# EAGLE board M225A (EAGLE 6.6.0)
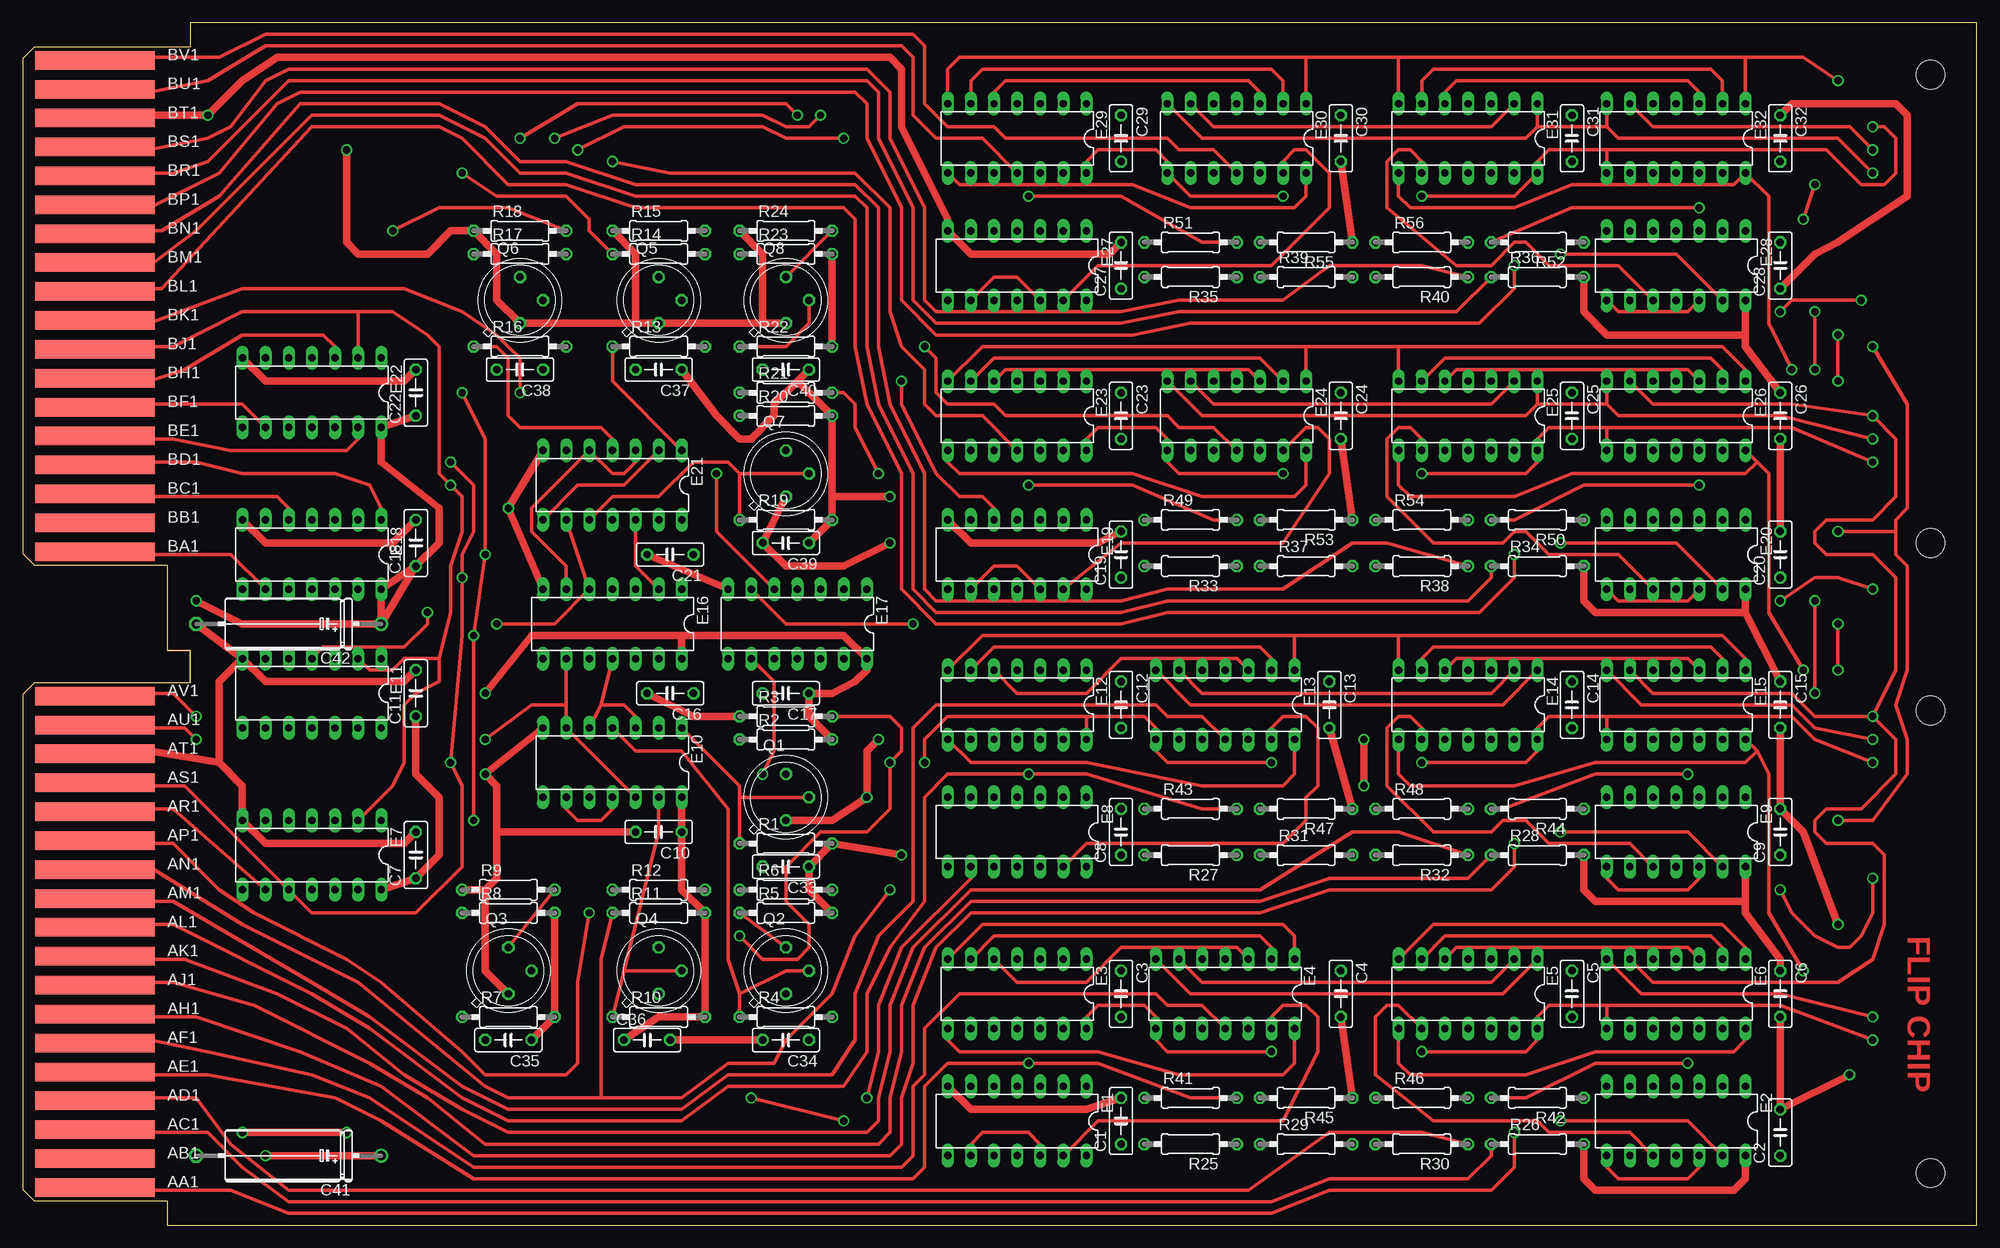
[diagram p2: board, top side]
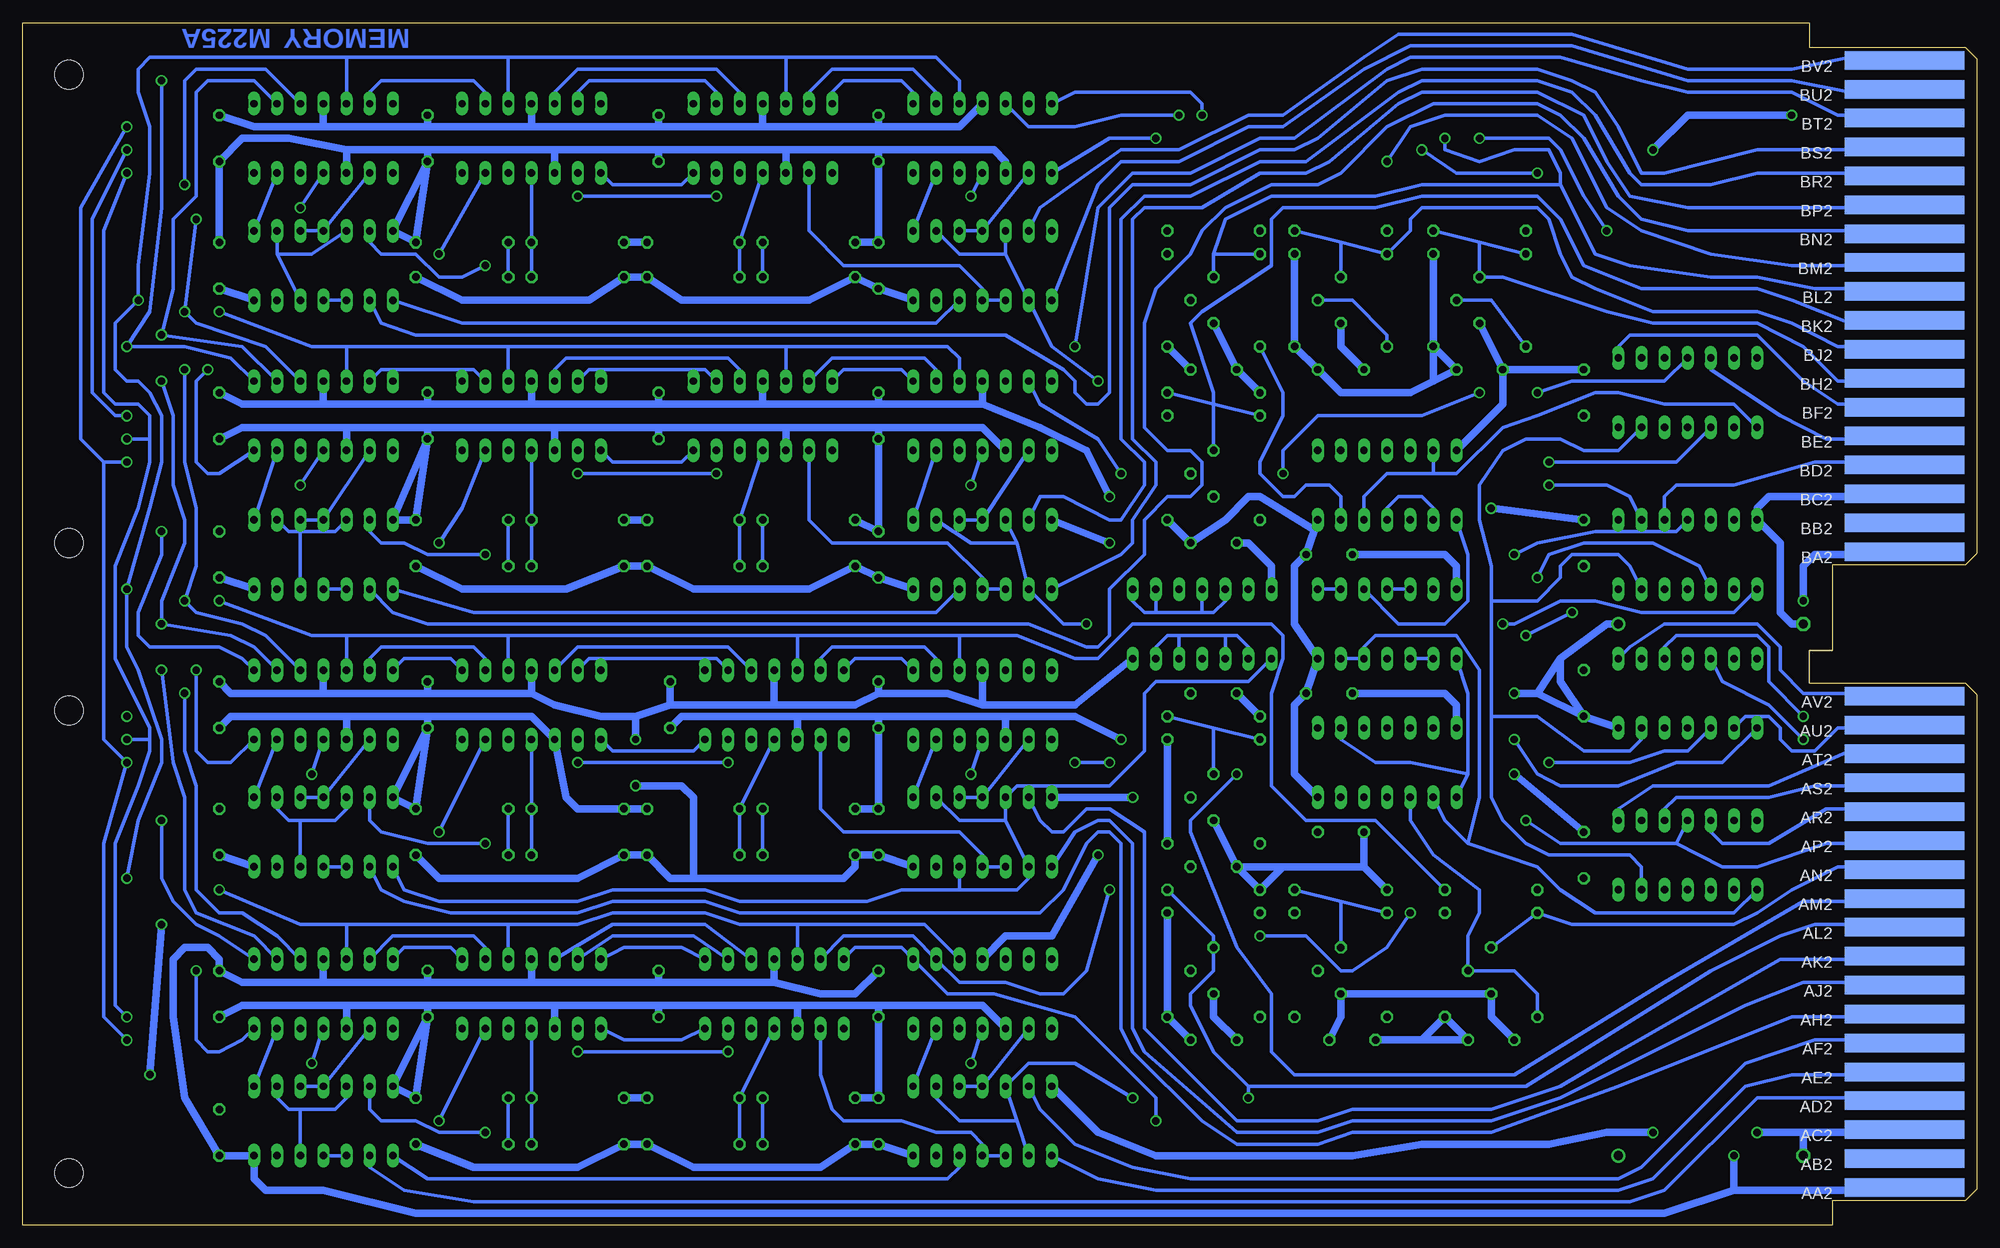
[diagram p3: board, bottom side, seen from below]

Size 214.63 x 132.08 mm. Coordinates in mm from the lower left corner, seen from the top.
Copper layers (1+16): Top 0.035mm / dielectric 1.5mm / Bottom 0.035mm
Design rules "16mils": minimum track width 16mil, minimum drill 32mil, track to track 15mil, track to pad 10mil, pad to pad 10mil, via to via 10mil, smd to smd 10mil, copper to edge 13mil, drill to drill 10mil, minimum pad ring 10mil, minimum via ring 8mil, stop-mask expansion 0mil, vias tented up to drill 0mil, thermal gap 10mil
Net classes: 1 supply: width 0.813 mm

## Footprints (pad centres in the part's own frame; a part is rotated, then mirrored left to right if it is on the bottom)
C050-025X075 = drill 0.813 octagon: 1 -2.54,0; 2 2.54,0
E12-8 = drill 1.016: + -10.16,0 | drill 1.016 octagon: - 10.16,0
DIL14 = drill 0.813 long: 1 -7.62,-3.81; 2 -5.08,-3.81; 3 -2.54,-3.81; 4 0,-3.81; 5 2.54,-3.81; 6 5.08,-3.81; 7 7.62,-3.81; 8 7.62,3.81; 9 5.08,3.81; 10 2.54,3.81; 11 0,3.81; 12 -2.54,3.81; 13 -5.08,3.81; 14 -7.62,3.81
TO5 = drill 0.813 octagon: 1 0,-2.54; 2 2.54,0; 3 0,2.54
0207/10 = drill 0.813 octagon: 1 -5.08,0; 2 5.08,0
DOUBLE-LONG = hole 3.175: 209.55,56.515; 209.55,5.715; 209.55,74.93; 209.55,126.365
EDGE-CON4 = smd 13.106 x 2.032: AA1 7.938,4.128; AB1 7.938,7.303; AC1 7.938,10.477; AD1 7.938,13.652; AE1 7.938,16.828; AF1 7.938,20.003; AH1 7.938,23.177; AJ1 7.938,26.352; AK1 7.938,29.527; AL1 7.938,32.703; AM1 7.938,35.877; AN1 7.938,39.053; AP1 7.938,42.227; AR1 7.938,45.403; AS1 7.938,48.578; AT1 7.938,51.752; AU1 7.938,54.928; AV1 7.938,58.102; BA1 7.938,73.978; BB1 7.938,77.153; BC1 7.938,80.328; BD1 7.938,83.502; BE1 7.938,86.677; BF1 7.938,89.853; BH1 7.938,93.028; BJ1 7.938,96.203; BK1 7.938,99.377; BL1 7.938,102.552; BM1 7.938,105.728; BN1 7.938,108.903; BP1 7.938,112.078; BR1 7.938,115.252; BS1 7.938,118.427; BT1 7.938,121.603; BU1 7.938,124.778; BV1 7.938,127.953 | smd 13.106 x 2.032 bottom: AA2 7.938,4.128; AB2 7.938,7.303; AC2 7.938,10.477; AD2 7.938,13.652; AE2 7.938,16.828; AF2 7.938,20.003; AH2 7.938,23.177; AJ2 7.938,26.352; AK2 7.938,29.527; AL2 7.938,32.703; AM2 7.938,35.877; AN2 7.938,39.053; AP2 7.938,42.227; AR2 7.938,45.403; AS2 7.938,48.578; AT2 7.938,51.752; AU2 7.938,54.928; AV2 7.938,58.102; BA2 7.938,73.978; BB2 7.938,77.153; BC2 7.938,80.328; BD2 7.938,83.502; BE2 7.938,86.677; BF2 7.938,89.853; BH2 7.938,93.028; BJ2 7.938,96.203; BK2 7.938,99.377; BL2 7.938,102.552; BM2 7.938,105.728; BN2 7.938,108.903; BP2 7.938,112.078; BR2 7.938,115.252; BS2 7.938,118.427; BT2 7.938,121.603; BU2 7.938,124.778; BV2 7.938,127.953

## Placement (x,y rotation side)
C1  .01uF  [C050-025X075]  120.65,11.43 90 top
C2  .01uF  [C050-025X075]  193.04,10.16 90 top
C3  .01uF  [C050-025X075]  120.65,25.4 270 top
C4  .01uF  [C050-025X075]  144.78,25.4 270 top
C5  .01uF  [C050-025X075]  170.18,25.4 270 top
C6  .01uF  [C050-025X075]  193.04,25.4 270 top
C7  .01uF  [C050-025X075]  43.18,40.64 90 top
C8  .01uF  [C050-025X075]  120.65,43.18 90 top
C9  .01uF  [C050-025X075]  193.04,43.18 90 top
C10  .01uF  [C050-025X075]  69.85,43.18 180 top
C11  .01uF  [C050-025X075]  43.18,58.42 90 top
C12  .01uF  [C050-025X075]  120.65,57.15 270 top
C13  .01uF  [C050-025X075]  143.51,57.15 270 top
C14  .01uF  [C050-025X075]  170.18,57.15 270 top
C15  .01uF  [C050-025X075]  193.04,57.15 270 top
C16  .01uF  [C050-025X075]  71.12,58.42 180 top
C17  .01uF  [C050-025X075]  83.82,58.42 180 top
C18  .01uF  [C050-025X075]  43.18,74.93 90 top
C19  .01uF  [C050-025X075]  120.65,73.66 90 top
C20  .01uF  [C050-025X075]  193.04,73.66 90 top
C21  .01uF  [C050-025X075]  71.12,73.66 180 top
C22  .01uF  [C050-025X075]  43.18,91.44 90 top
C23  .01uF  [C050-025X075]  120.65,88.9 270 top
C24  .01uF  [C050-025X075]  144.78,88.9 270 top
C25  .01uF  [C050-025X075]  170.18,88.9 270 top
C26  .01uF  [C050-025X075]  193.04,88.9 270 top
C27  .01uF  [C050-025X075]  120.65,105.41 90 top
C28  .01uF  [C050-025X075]  193.04,105.41 90 top
C29  .01uF  [C050-025X075]  120.65,119.38 270 top
C30  .01uF  [C050-025X075]  144.78,119.38 270 top
C31  .01uF  [C050-025X075]  170.18,119.38 270 top
C32  .01uF  [C050-025X075]  193.04,119.38 270 top
C33  .01uF  [C050-025X075]  83.82,39.37 180 top
C34  .01uF  [C050-025X075]  83.82,20.32 180 top
C35  .01uF  [C050-025X075]  53.34,20.32 180 top
C36  .01uF  [C050-025X075]  68.58,20.32 0 top
C37  .01uF  [C050-025X075]  69.85,93.98 180 top
C38  .01uF  [C050-025X075]  54.61,93.98 180 top
C39  .01uF  [C050-025X075]  83.82,74.93 180 top
C40  .01uF  [C050-025X075]  83.82,93.98 180 top
C41  6.8uF  [E12-8]  29.21,7.62 180 top
C42  6.8uF  [E12-8]  29.21,66.04 180 top
E1  7402N  [DIL14]  109.22,11.43 180 top
E2  7402N  [DIL14]  181.61,11.43 180 top
E3  7481  [DIL14]  109.22,25.4 180 top
E4  7481  [DIL14]  132.08,25.4 180 top
E5  7481  [DIL14]  158.75,25.4 180 top
E6  7481  [DIL14]  181.61,25.4 180 top
E7  74H53N  [DIL14]  31.75,40.64 180 top
E8  7402N  [DIL14]  109.22,43.18 180 top
E9  7402N  [DIL14]  181.61,43.18 180 top
E10  N8881N  [DIL14]  64.77,50.8 180 top
E11  74H53N  [DIL14]  31.75,58.42 180 top
E12  7481  [DIL14]  109.22,57.15 180 top
E13  7481  [DIL14]  132.08,57.15 180 top
E14  7481  [DIL14]  158.75,57.15 180 top
E15  7481  [DIL14]  181.61,57.15 180 top
E16  74H00N  [DIL14]  64.77,66.04 180 top
E17  7440N  [DIL14]  85.09,66.04 180 top
E18  74H53N  [DIL14]  31.75,73.66 180 top
E19  7402N  [DIL14]  109.22,73.66 180 top
E20  7402N  [DIL14]  181.61,73.66 180 top
E21  N8881N  [DIL14]  64.77,81.28 180 top
E22  74H53N  [DIL14]  31.75,91.44 180 top
E23  7481  [DIL14]  109.22,88.9 180 top
E24  7481  [DIL14]  133.35,88.9 180 top
E25  7481  [DIL14]  158.75,88.9 180 top
E26  7481  [DIL14]  181.61,88.9 180 top
E27  7402N  [DIL14]  109.22,105.41 180 top
E28  7402N  [DIL14]  181.61,105.41 180 top
E29  7481  [DIL14]  109.22,119.38 180 top
E30  7481  [DIL14]  133.35,119.38 180 top
E31  7481  [DIL14]  158.75,119.38 180 top
E32  7481  [DIL14]  181.61,119.38 180 top
Q1  DEC3009  [TO5]  83.82,46.99 0 top
Q2  DEC3009  [TO5]  83.82,27.94 0 top
Q3  DEC3009  [TO5]  53.34,27.94 0 top
Q4  DEC3009  [TO5]  69.85,27.94 0 top
Q5  DEC3009  [TO5]  69.85,101.6 0 top
Q6  DEC3009  [TO5]  54.61,101.6 0 top
Q7  DEC3009  [TO5]  83.82,82.55 0 top
Q8  DEC3009  [TO5]  83.82,101.6 0 top
R1  330  [0207/10]  83.82,41.91 0 top
R2  100  [0207/10]  83.82,53.34 0 top
R3  1500  [0207/10]  83.82,55.88 0 top
R4  330  [0207/10]  83.82,22.86 0 top
R5  100  [0207/10]  83.82,34.29 0 top
R6  1500  [0207/10]  83.82,36.83 0 top
R7  330  [0207/10]  53.34,22.86 0 top
R8  100  [0207/10]  53.34,34.29 0 top
R9  1500  [0207/10]  53.34,36.83 0 top
R10  330  [0207/10]  69.85,22.86 0 top
R11  100  [0207/10]  69.85,34.29 0 top
R12  1500  [0207/10]  69.85,36.83 0 top
R13  330  [0207/10]  69.85,96.52 0 top
R14  100  [0207/10]  69.85,106.68 0 top
R15  1500  [0207/10]  69.85,109.22 0 top
R16  330  [0207/10]  54.61,96.52 0 top
R17  100  [0207/10]  54.61,106.68 0 top
R18  1500  [0207/10]  54.61,109.22 0 top
R19  330  [0207/10]  83.82,77.47 0 top
R20  100  [0207/10]  83.82,88.9 0 top
R21  1500  [0207/10]  83.82,91.44 0 top
R22  330  [0207/10]  83.82,96.52 0 top
R23  100  [0207/10]  83.82,106.68 0 top
R24  1500  [0207/10]  83.82,109.22 0 top
R25  1K  [0207/10]  128.27,8.89 180 top
R26  1K  [0207/10]  166.37,8.89 0 top
R27  1K  [0207/10]  128.27,40.64 180 top
R28  1K  [0207/10]  166.37,40.64 0 top
R29  1K  [0207/10]  140.97,8.89 0 top
R30  1K  [0207/10]  153.67,8.89 180 top
R31  1K  [0207/10]  140.97,40.64 0 top
R32  1K  [0207/10]  153.67,40.64 180 top
R33  1K  [0207/10]  128.27,72.39 180 top
R34  1K  [0207/10]  166.37,72.39 0 top
R35  1K  [0207/10]  128.27,104.14 180 top
R36  1K  [0207/10]  166.37,104.14 0 top
R37  1K  [0207/10]  140.97,72.39 0 top
R38  1K  [0207/10]  153.67,72.39 180 top
R39  1K  [0207/10]  140.97,104.14 0 top
R40  1K  [0207/10]  153.67,104.14 180 top
R41  3K  [0207/10]  128.27,13.97 0 top
R42  3K  [0207/10]  166.37,13.97 180 top
R43  3K  [0207/10]  128.27,45.72 0 top
R44  3K  [0207/10]  166.37,45.72 180 top
R45  3K  [0207/10]  140.97,13.97 180 top
R46  3K  [0207/10]  153.67,13.97 0 top
R47  3K  [0207/10]  140.97,45.72 180 top
R48  3K  [0207/10]  153.67,45.72 0 top
R49  3K  [0207/10]  128.27,77.47 0 top
R50  3K  [0207/10]  166.37,77.47 180 top
R51  3K  [0207/10]  128.27,107.95 0 top
R52  3K  [0207/10]  166.37,107.95 180 top
R53  3K  [0207/10]  140.97,77.47 180 top
R54  3K  [0207/10]  153.67,77.47 0 top
R55  3K  [0207/10]  140.97,107.95 180 top
R56  3K  [0207/10]  153.67,107.95 0 top
U$1  OUTLINE-DOUBLE-LONG  [DOUBLE-LONG]  0,0 0 top
U$3  [EDGE-CON4]  0,0 0 top

## Tracks (layer width: path | path; a pad name or v marks a point on that pad's centre or on a via)
GND  (via drill 0.81)
  Top 0.813: Q3.1 50.8,27.94 50.8,36.83 | 50.8,36.83 R9.1 | 50.8,36.83 52.07,38.1 52.07,43.18 | 52.07,43.18 52.07,48.26 v50.8,49.53 E10.7 | C10.2 52.07,43.18 | 81.28,99.06 Q5.1 67.31,99.06 | 81.28,99.06 Q8.1 | 67.31,99.06 Q6.1 52.07,101.6 52.07,106.68 R18.1 46.99,109.22 44.45,106.68 36.83,106.68 35.56,107.95 v35.56,118.11 | R15.1 67.31,106.68 67.31,99.06 | R24.1 81.28,106.68 81.28,99.06 | R45.1 C4.2 | v24.13,10.16 v35.56,10.16 | v93.98,53.34 92.71,52.07 v92.71,46.99 88.9,44.45 Q1.1 | C36.2 C34.2 | E11.7 C42.- | U$3.AT1 8.89,52.07 13.97,52.07 21.59,50.8 | 21.59,50.8 21.59,59.69 E11.7 | 21.59,50.8 24.13,48.26 E7.7 26.67,41.91 41.91,41.91 C7.2 | U$3.BT1 8.89,121.92 v20.32,121.92 24.13,125.73 27.94,128.27 95.25,128.27 96.52,127 96.52,120.65 101.6,110.49 E27.7 104.14,106.68 119.38,106.68 C27.2 | E22.7 26.67,92.71 41.91,92.71 C22.2 | E21.7 v53.34,78.74 E16.7 | E18.7 26.67,74.93 40.64,74.93 C18.2 | C11.2 41.91,59.69 26.67,59.69 E11.7 | C6.2 C2.2 v200.66,16.51 | C15.2 C9.2 195.58,43.18 v199.39,33.02 | C26.2 C20.2 | E1.7 104.14,12.7 116.84,12.7 C1.2 | C13.2 R47.1 | C24.2 R53.1 | Q7.1 C39.2 83.82,72.39 90.17,72.39 v95.25,74.93 | C16.2 73.66,55.88 R3.1 | C21.2 E17.7 | R55.1 C30.2 | E19.7 104.14,74.93 118.11,74.93 C19.2
  Bottom 0.813: C35.2 53.34,22.86 Q3.1 Q4.1 69.85,22.86 C36.2 | C7.2 v50.8,49.53 | R12.1 67.31,39.37 | 67.31,39.37 C10.2 | C17.2 R3.1 | Q1.1 C33.2 | C33.2 76.2,39.37 | 76.2,39.37 67.31,39.37 | C33.2 R6.1 76.2,39.37 | C34.2 83.82,22.86 Q2.1 | R45.1 R46.1 | R41.1 C1.2 C3.2 120.65,24.13 | C37.2 69.85,96.52 Q5.1 | C22.2 C38.2 | E21.7 52.07,90.17 C38.2 | Q8.1 C40.2 R21.1 | C38.2 Q6.1 | E17.7 77.47,72.39 80.01,74.93 C39.2 | E16.7 57.15,72.39 58.42,73.66 C21.2 | R47.1 R48.1 153.67,45.72 154.94,46.99 E14.10 158.75,55.88 170.18,55.88 | R43.1 C8.2 C12.2 120.65,55.88 | C14.2 E9.7 R44.1 C14.2 | C14.2 170.18,55.88 | 170.18,55.88 179.07,55.88 | 179.07,55.88 E15.10 | C15.2 191.77,55.88 179.07,55.88 | R49.1 C19.2 C23.2 120.65,87.63 | C25.2 R50.1 E20.7 C25.2 | R54.1 R53.1 | R55.1 R56.1 | C31.2 R52.1 E28.7 C31.2 | R51.1 C27.2 C29.2 120.65,118.11 | C5.2 E2.7 R42.1 C5.2 | U$3.AC2 10.16,10.16 19.05,10.16 | C41.- 19.05,10.16 | 19.05,10.16 v24.13,10.16 | E10.7 57.15,57.15 58.42,58.42 C16.2 | E8.7 v92.71,46.99 | E12.10 106.68,55.88 | 106.68,55.88 120.65,55.88 | C13.2 142.24,55.88 129.54,55.88 | 129.54,55.88 E13.10 | 120.65,55.88 129.54,55.88 | C26.2 190.5,87.63 179.07,87.63 | 179.07,87.63 E26.10 | C25.2 170.18,87.63 | 170.18,87.63 179.07,87.63 | E25.10 156.21,87.63 | 156.21,87.63 170.18,87.63 | C24.2 144.78,87.63 | 144.78,87.63 156.21,87.63 | E24.10 130.81,87.63 | 130.81,87.63 144.78,87.63 | 120.65,87.63 130.81,87.63 | E23.10 109.22,87.63 120.65,87.63 | C42.- 20.32,66.04 21.59,67.31 21.59,74.93 E18.7 24.13,78.74 22.86,80.01 10.16,80.01 U$3.BC2 | E19.7 v95.25,74.93 | C6.2 190.5,24.13 179.07,24.13 | 179.07,24.13 E6.10 | C5.2 170.18,24.13 | 170.18,24.13 179.07,24.13 | E5.10 156.21,24.13 | 156.21,24.13 170.18,24.13
  Bottom 0.813: 156.21,24.13 144.78,24.13 | 144.78,24.13 C4.2 | E4.10 129.54,24.13 | 129.54,24.13 144.78,24.13 | 120.65,24.13 129.54,24.13 | E3.10 109.22,24.13 120.65,24.13 | 179.07,118.11 185.42,119.38 190.5,119.38 C32.2 C28.2 | 179.07,118.11 E32.10 | C31.2 170.18,118.11 | 170.18,118.11 179.07,118.11 | E31.10 156.21,118.11 | 156.21,118.11 170.18,118.11 | C30.2 144.78,118.11 | 144.78,118.11 156.21,118.11 | E30.10 130.81,118.11 | 130.81,118.11 144.78,118.11 | 120.65,118.11 130.81,118.11 | E29.10 106.68,116.84 107.95,118.11 120.65,118.11 | E1.7 96.52,10.16 90.17,7.62 68.58,7.62 60.96,8.89 46.99,8.89 40.64,10.16 v35.56,10.16 | 106.68,55.88 99.06,55.88 v93.98,53.34 | v20.32,121.92 31.75,121.92 v35.56,118.11 | C18.2 v53.34,78.74 | v200.66,16.51 v199.39,33.02
N$1
  Bottom 0.406: E3.9 E1.4 E1.3
N$2  (via drill 0.81)
  Top 0.406: U$3.AH1 8.89,22.86 19.05,22.86 30.48,19.05 39.37,15.24 49.53,7.62 95.25,7.62 96.52,8.89 96.52,13.97 97.79,17.78 97.79,24.13 100.33,30.48 104.14,34.29 135.89,34.29 143.51,36.83 161.29,36.83 163.83,39.37 v163.83,41.91
  Bottom 0.406: E9.6 176.53,44.45 175.26,43.18 170.18,41.91 v163.83,41.91
N$3
  Bottom 0.406: E1.6 102.87,12.7 99.06,8.89 92.71,6.35 86.36,5.08 39.37,5.08 36.83,6.35 25.4,17.78 17.78,20.32 8.89,20.32 U$3.AF2
N$4
  Bottom 0.406: E1.1 E3.13
N$5
  Top 0.406: E1.13 118.11,11.43 138.43,11.43 142.24,19.05 142.24,22.86 140.97,24.13 138.43,24.13 137.16,22.86 E4.13
N$6
  Bottom 0.406: E4.9 127,16.51 125.73,12.7 124.46,11.43 118.11,11.43 114.3,10.16 110.49,10.16 109.22,8.89 E1.11 E1.10
N$7
  Bottom 0.406: U$3.AK2 10.16,29.21 21.59,29.21 39.37,19.05 45.72,15.24 53.34,12.7 68.58,12.7 72.39,11.43 81.28,11.43 91.44,21.59 91.44,43.18 95.25,45.72 97.79,45.72 100.33,43.18 101.6,43.18 102.87,44.45 E8.6
N$8
  Bottom 0.406: U$3.AE2 10.16,16.51 20.32,16.51 25.4,15.24 35.56,5.08 39.37,3.81 90.17,3.81 96.52,5.08 E1.8
N$11  (via drill 0.81)
  Top 0.406: U$3.BK1 8.89,99.06 13.97,99.06 24.13,102.87 41.91,102.87 48.26,100.33 52.07,97.79 53.34,96.52 54.61,95.25 v54.61,91.44 | E17.5 76.2,76.2 v76.2,82.55
  Bottom 0.406: v54.61,91.44 60.96,88.9 72.39,88.9 76.2,85.09 v76.2,82.55 | E17.5 82.55,68.58 83.82,67.31 85.09,67.31 | 85.09,67.31 90.17,67.31 | 90.17,67.31 91.44,67.31 92.71,68.58 E17.1 | E17.2 90.17,67.31 | E17.4 85.09,67.31
N$13
  Top 0.406: U$3.AF1 10.16,20.32 13.97,20.32 20.32,19.05 31.75,16.51 38.1,13.97 49.53,6.35 96.52,6.35 97.79,7.62 97.79,15.24 99.06,16.51 99.06,21.59 102.87,25.4 124.46,25.4 125.73,24.13 129.54,24.13 E4.11
  Bottom 0.406: R29.1 R45.2 E4.11
N$14  (via drill 0.81)
  Top 0.406: U$3.AE1 10.16,16.51 20.32,16.51 34.29,13.97 39.37,11.43 49.53,5.08 97.79,5.08 99.06,6.35 99.06,15.24 101.6,17.78 v110.49,17.78 118.11,17.78 128.27,13.97 R41.2
  Bottom 0.406: R41.2 R25.1 | E3.11 v110.49,17.78
N$15
  Top 0.406: U$3.AD1 8.89,13.97 19.05,13.97 22.86,8.89 29.21,3.81 134.62,3.81 143.51,10.16 153.67,10.16 R30.1
  Bottom 0.406: E5.11 R46.2 R30.1
N$16
  Top 0.406: Q1.2 78.74,46.99 | 78.74,46.99 R1.1 | 78.74,46.99 78.74,48.26 E10.1
N$18  (via drill 0.81)
  Top 0.406: U$3.AC1 8.89,10.16 20.32,10.16 24.13,6.35 29.21,2.54 137.16,2.54 143.51,5.08 158.75,5.08 161.29,7.62 R26.1 | v182.88,17.78 172.72,17.78 165.1,13.97 R42.2
  Bottom 0.406: R26.1 R42.2 | E6.11 v182.88,17.78
N$19
  Top 0.406: R4.1 78.74,25.4 | 78.74,25.4 83.82,27.94 Q2.2 | 78.74,25.4 77.47,29.21 77.47,45.72 72.39,52.07 67.31,52.07 E10.4
N$20  (via drill 0.81)
  Top 0.406: v49.53,44.45 v49.53,64.77 v50.8,73.66 50.8,86.36 v48.26,91.44 | E11.4 33.02,63.5 41.91,63.5 44.45,66.04 v44.45,67.31
  Bottom 0.406: v44.45,67.31 v49.53,64.77 | U$3.AP2 10.16,41.91 16.51,41.91 24.13,39.37 27.94,39.37 33.02,41.91 | 33.02,41.91 E7.4 | 33.02,41.91 45.72,41.91 v49.53,44.45 | E18.4 33.02,76.2 41.91,76.2 48.26,74.93 v50.8,73.66 | E22.4 34.29,92.71 44.45,92.71 v48.26,91.44
N$21
  Bottom 0.406: R7.1 48.26,25.4 50.8,27.94 Q3.2 55.88,31.75 54.61,34.29 54.61,36.83 59.69,40.64 62.23,44.45 E10.10
N$23
  Top 0.406: Q4.2 66.04,27.94 | 66.04,27.94 R10.1 | 66.04,27.94 69.85,43.18 E10.13
N$25
  Top 0.406: R13.1 64.77,92.71 E21.1
  Bottom 0.406: Q5.2 68.58,101.6 64.77,97.79 R13.1
N$26  (via drill 0.81)
  Top 0.406: E8.9 104.14,38.1 96.52,30.48 93.98,24.13 93.98,19.05 v92.71,13.97 | E2.8 173.99,6.35 175.26,5.08 182.88,5.08 184.15,6.35 E2.12 | E9.8 173.99,38.1 175.26,36.83 182.88,36.83 184.15,38.1 E9.12 | E1.12 111.76,8.89 110.49,10.16 105.41,10.16 104.14,8.89 E1.9
  Bottom 0.406: E1.2 114.3,13.97 111.76,11.43 105.41,11.43 | 105.41,11.43 E1.9 | 105.41,11.43 E1.5 104.14,17.78 99.06,17.78 v92.71,13.97 | E2.5 179.07,13.97 180.34,12.7 184.15,12.7 | 184.15,12.7 185.42,12.7 186.69,13.97 E2.2 | E2.12 184.15,12.7 | E2.8 170.18,5.08 113.03,5.08 111.76,6.35 E1.12 | 106.68,44.45 E8.5 105.41,48.26 95.25,48.26 91.44,52.07 91.44,58.42 90.17,59.69 80.01,59.69 E17.8 | 106.68,44.45 E8.9 104.14,38.1 105.41,36.83 111.76,36.83 | E8.2 111.76,44.45 106.68,44.45 | E9.8 172.72,36.83 168.91,35.56 153.67,35.56 149.86,36.83 139.7,36.83 135.89,35.56 121.92,35.56 118.11,36.83 111.76,36.83 | 111.76,36.83 E8.12 | E9.12 184.15,44.45 | 184.15,44.45 185.42,44.45 186.69,45.72 E9.2 | E9.5 179.07,45.72 180.34,44.45 184.15,44.45
N$27
  Top 0.406: E21.4 64.77,86.36 63.5,87.63 54.61,87.63 53.34,88.9 53.34,95.25 52.07,96.52 R16.1
  Bottom 0.406: Q6.2 53.34,101.6 R16.1
N$28
  Bottom 0.406: U$3.AJ2 10.16,26.67 19.05,26.67 25.4,24.13 45.72,13.97 53.34,11.43 68.58,11.43 72.39,10.16 81.28,10.16 91.44,19.05 92.71,21.59 92.71,41.91 95.25,44.45 96.52,44.45 99.06,43.18 E8.8
N$29
  Top 0.406: R19.1 78.74,82.55 | 78.74,82.55 Q7.2 | 78.74,82.55 77.47,83.82 73.66,83.82 69.85,80.01 64.77,80.01 E21.10
N$30  (via drill 0.81)
  Top 0.406: E20.8 175.26,68.58 182.88,68.58 E20.12 | v96.52,92.71 96.52,90.17 100.33,82.55 102.87,80.01 105.41,80.01 106.68,78.74 E19.5 | E17.6 83.82,66.04 v97.79,66.04 | E28.8 175.26,100.33 182.88,100.33 E28.12 | E19.12 109.22,72.39 106.68,72.39 E19.9 | E27.12 109.22,104.14 106.68,104.14 E27.9
  Bottom 0.406: E20.2 185.42,76.2 184.15,76.2 | 184.15,76.2 180.34,76.2 E20.5 | E20.12 184.15,76.2 | E28.12 186.69,106.68 | 186.69,106.68 E28.2 | E28.5 182.88,106.68 186.69,106.68 | E19.2 110.49,74.93 105.41,74.93 | 105.41,74.93 E19.5 | 105.41,74.93 E19.9 100.33,66.04 v97.79,66.04 | E20.8 165.1,67.31 114.3,67.31 E19.12 | E27.2 111.76,106.68 106.68,106.68 | 106.68,106.68 E27.9 101.6,96.52 v96.52,92.71 | E27.5 106.68,106.68 | E27.12 114.3,99.06 166.37,99.06 E28.8
N$31
  Top 0.406: Q8.2 86.36,99.06 83.82,96.52 R22.1
  Bottom 0.406: E21.13 69.85,80.01 71.12,81.28 73.66,81.28 74.93,80.01 76.2,80.01 78.74,82.55 78.74,83.82 76.2,88.9 76.2,91.44 R22.1
N$32
  Bottom 0.406: U$3.BR2 10.16,115.57 24.13,115.57 29.21,114.3 36.83,114.3 38.1,115.57 41.91,121.92 44.45,124.46 48.26,125.73 60.96,125.73 63.5,124.46 73.66,116.84 78.74,116.84 86.36,113.03 91.44,113.03 93.98,110.49 93.98,86.36 91.44,83.82 91.44,81.28 93.98,77.47 95.25,77.47 100.33,80.01 102.87,80.01 E19.6
N$33  (via drill 0.81)
  Top 0.406: U$3.AL1 8.89,33.02 16.51,33.02 31.75,25.4 38.1,21.59 48.26,13.97 53.34,11.43 72.39,11.43 77.47,15.24 90.17,15.24 92.71,19.05 92.71,25.4 95.25,30.48 99.06,35.56 99.06,46.99 101.6,49.53 v110.49,49.53 116.84,49.53 129.54,45.72 R43.2
  Bottom 0.406: R43.2 R27.1 | E12.11 v110.49,49.53
N$34  (via drill 0.81)
  Top 0.406: R28.1 158.75,38.1 143.51,38.1 135.89,35.56 104.14,35.56 99.06,30.48 96.52,24.13 96.52,19.05 95.25,13.97 95.25,10.16 93.98,8.89 50.8,8.89 44.45,13.97 38.1,17.78 25.4,24.13 16.51,26.67 10.16,26.67 U$3.AJ1 | R44.2 162.56,45.72 172.72,49.53 v182.88,49.53
  Bottom 0.406: R44.2 R28.1 | E15.11 v182.88,49.53
N$35
  Top 0.406: U$3.AM1 10.16,35.56 16.51,35.56 31.75,26.67 38.1,22.86 48.26,15.24 53.34,12.7 72.39,12.7 77.47,16.51 88.9,16.51 91.44,20.32 91.44,25.4 93.98,31.75 97.79,35.56 97.79,54.61 100.33,57.15 124.46,57.15 125.73,55.88 129.54,55.88 E13.11
  Bottom 0.406: R31.1 R47.2 E13.11
N$36
  Top 0.406: U$3.AK1 8.89,29.21 17.78,29.21 27.94,25.4 35.56,21.59 41.91,16.51 48.26,12.7 53.34,10.16 92.71,10.16 93.98,11.43 93.98,13.97 95.25,19.05 95.25,24.13 97.79,30.48 104.14,36.83 135.89,36.83 146.05,43.18 151.13,43.18 R32.1
  Bottom 0.406: R32.1 R48.2 E14.11
N$37  (via drill 0.81)
  Top 0.406: v64.77,116.84 71.12,115.57 91.44,115.57 95.25,111.76 95.25,100.33 96.52,96.52 99.06,93.98 99.06,90.17 100.33,88.9 105.41,88.9 E23.11 | v110.49,81.28 121.92,81.28 130.81,77.47 R49.2
  Bottom 0.406: R49.2 R33.1 | U$3.BM2 10.16,105.41 20.32,105.41 29.21,106.68 36.83,109.22 40.64,111.76 44.45,119.38 48.26,121.92 58.42,121.92 62.23,120.65 v64.77,116.84 | E23.11 v110.49,81.28
N$38  (via drill 0.81)
  Top 0.406: U$3.BM1 8.89,105.41 13.97,105.41 19.05,109.22 31.75,121.92 45.72,121.92 50.8,119.38 54.61,115.57 59.69,115.57 67.31,113.03 91.44,113.03 92.71,111.76 92.71,96.52 93.98,90.17 97.79,82.55 97.79,69.85 100.33,67.31 120.65,67.31 125.73,68.58 158.75,68.58 161.29,71.12 R34.1 | R50.2 163.83,77.47 171.45,81.28 v184.15,81.28
  Bottom 0.406: R50.2 R34.1 | E26.11 v184.15,81.28
N$39  (via drill 0.81)
  Top 0.406: U$3.BU1 8.89,124.46 13.97,124.46 20.32,125.73 26.67,129.54 96.52,129.54 97.79,128.27 97.79,121.92 100.33,119.38 105.41,119.38 E29.11 | v110.49,113.03 120.65,113.03 129.54,107.95 R51.2
  Bottom 0.406: R51.2 R35.1 | E29.11 v110.49,113.03
N$40  (via drill 0.81)
  Top 0.406: U$3.BR1 8.89,115.57 16.51,115.57 20.32,116.84 29.21,125.73 92.71,125.73 93.98,124.46 93.98,119.38 97.79,111.76 97.79,101.6 100.33,99.06 120.65,99.06 127,100.33 157.48,100.33 R36.1 | R52.2 170.18,111.76 v184.15,111.76
  Bottom 0.406: R36.1 R52.2 | E32.11 v184.15,111.76
N$41  (via drill 0.81)
  Top 0.406: v99.06,96.52 100.33,95.25 100.33,91.44 101.6,90.17 106.68,90.17 107.95,88.9 125.73,88.9 127,87.63 130.81,87.63 E24.11
  Bottom 0.406: R37.1 R53.2 E24.11 | U$3.BT2 10.16,121.92 15.24,121.92 20.32,124.46 31.75,124.46 36.83,125.73 45.72,128.27 62.23,128.27 64.77,127 74.93,119.38 78.74,119.38 86.36,115.57 92.71,115.57 96.52,111.76 v99.06,96.52
N$42
  Top 0.406: U$3.BN1 8.89,109.22 15.24,109.22 21.59,113.03 30.48,123.19 45.72,123.19 50.8,120.65 54.61,116.84 59.69,116.84 67.31,114.3 91.44,114.3 93.98,111.76 93.98,96.52 95.25,90.17 99.06,82.55 99.06,69.85 100.33,68.58 120.65,68.58 125.73,69.85 138.43,69.85 146.05,74.93 149.86,74.93 R38.1
  Bottom 0.406: R38.1 R54.2 E25.11
N$43
  Top 0.406: U$3.BV1 11.43,128.27 21.59,128.27 26.67,130.81 97.79,130.81 99.06,129.54 99.06,123.19 101.6,120.65 106.68,120.65 107.95,119.38 125.73,119.38 127,118.11 130.81,118.11 E30.11
  Bottom 0.406: R39.1 R55.2 E30.11
N$44
  Top 0.406: U$3.BS1 8.89,118.11 13.97,118.11 20.32,119.38 22.86,120.65 26.67,125.73 29.21,127 92.71,127 95.25,124.46 95.25,119.38 99.06,111.76 99.06,101.6 100.33,100.33 120.65,100.33 127,101.6 138.43,101.6 143.51,105.41 153.67,105.41 R40.1
  Bottom 0.406: R40.1 R56.2 E31.11
N$45
  Top 0.406: U$3.BE1 8.89,86.36 16.51,86.36 22.86,85.09 35.56,85.09 36.83,86.36 E22.13
  Bottom 0.406: E18.13 38.1,72.39 39.37,73.66 44.45,73.66 45.72,72.39 45.72,71.12 48.26,68.58 53.34,68.58 | 53.34,68.58 53.34,72.39 54.61,77.47 54.61,81.28 52.07,85.09 49.53,86.36 45.72,86.36 43.18,85.09 39.37,85.09 E22.13 | 53.34,68.58 53.34,55.88 | 53.34,55.88 48.26,55.88 43.18,52.07 38.1,52.07 36.83,53.34 E11.13 | E7.13 36.83,39.37 38.1,40.64 46.99,40.64 49.53,41.91 52.07,44.45 53.34,46.99 53.34,55.88
N$46
  Top 0.406: U$3.BD1 8.89,83.82 19.05,83.82 24.13,82.55 34.29,82.55 38.1,81.28 39.37,78.74 E18.1
N$47  (via drill 0.81)
  Top 0.406: E7.2 40.64,48.26 41.91,50.8 41.91,57.15 43.18,58.42 45.72,59.69 45.72,62.23 | E22.2 36.83,100.33 | 36.83,100.33 24.13,100.33 16.51,96.52 8.89,96.52 U$3.BJ1 | 36.83,100.33 40.64,100.33 44.45,97.79 45.72,96.52 45.72,82.55 v46.99,81.28 48.26,80.01 48.26,76.2 46.99,72.39 46.99,67.31 45.72,62.23 | E11.2 38.1,60.96 40.64,60.96 41.91,62.23 45.72,62.23
  Bottom 0.406: E18.2 38.1,80.01 40.64,81.28 v46.99,81.28
N$48
  Bottom 0.406: U$3.BD2 10.16,83.82 17.78,83.82 26.67,81.28 33.02,81.28 34.29,80.01 E18.3
N$50
  Top 0.406: U$3.BC1 8.89,80.01 27.94,80.01 29.21,78.74 E18.5
N$51
  Top 0.406: U$3.BA1 8.89,73.66 22.86,73.66 E18.9
N$52  (via drill 0.81)
  Top 0.406: U$3.AS1 8.89,48.26 17.78,48.26 E7.10 31.75,34.29 43.18,34.29 48.26,39.37 48.26,48.26 v46.99,50.8 48.26,64.77 v48.26,71.12 48.26,73.66 49.53,76.2 49.53,81.28 v46.99,83.82
  Bottom 0.406: E18.10 30.48,72.39 35.56,74.93 43.18,74.93 46.99,73.66 v48.26,71.12 | E11.10 31.75,52.07 34.29,52.07 38.1,50.8 v46.99,50.8 | E22.10 33.02,83.82 v46.99,83.82
N$53
  Bottom 0.406: E7.1 39.37,45.72 35.56,48.26 22.86,48.26 13.97,52.07 8.89,52.07 U$3.AT2
N$54
  Bottom 0.406: U$3.BE2 8.89,86.36 16.51,86.36 21.59,88.9 29.21,93.98 E22.5
N$55
  Bottom 0.406: U$3.BF2 10.16,90.17 15.24,90.17 19.05,92.71 24.13,97.79 38.1,97.79 39.37,96.52 E22.1
N$56
  Top 0.406: U$3.BH1 8.89,92.71 13.97,92.71 17.78,93.98 24.13,97.79 33.02,97.79 34.29,96.52 E22.3
N$57
  Top 0.406: U$3.BF1 8.89,90.17 24.13,90.17 E22.9
N$58
  Bottom 0.406: U$3.AU2 8.89,54.61 15.24,54.61 17.78,52.07 20.32,52.07 21.59,53.34 21.59,54.61 22.86,55.88 25.4,55.88 E11.9
N$59  (via drill 0.81)
  Top 0.406: U$3.AV1 8.89,58.42 16.51,58.42 v19.05,55.88
  Bottom 0.406: E11.3 34.29,63.5 33.02,64.77 24.13,64.77 22.86,63.5 22.86,59.69 v19.05,55.88
N$60
  Bottom 0.406: U$3.AV2 11.43,58.42 19.05,58.42 21.59,60.96 21.59,63.5 24.13,66.04 34.29,66.04 38.1,63.5 E11.1
N$61  (via drill 0.81)
  Top 0.406: U$3.AU1 7.62,54.61 17.78,54.61 v19.05,53.34
  Bottom 0.406: E11.5 27.94,59.69 22.86,57.15 v19.05,53.34
N$62
  Top 0.406: U$3.AR1 8.89,45.72 16.51,45.72 E7.9
N$63
  Bottom 0.406: U$3.AS2 10.16,48.26 17.78,48.26 22.86,46.99 33.02,46.99 34.29,45.72 E7.3
N$64
  Bottom 0.406: U$3.AR2 8.89,45.72 16.51,45.72 22.86,41.91 27.94,41.91 29.21,43.18 E7.5
N$65  (via drill 0.81)
  Top 0.406: 59.69,57.15 E10.6 E10.12 | 59.69,57.15 E16.9 | v50.8,53.34 55.88,57.15 59.69,57.15
  Bottom 0.406: E16.10 E16.9 | E11.8 27.94,50.8 33.02,50.8 39.37,48.26 45.72,48.26 48.26,49.53 v50.8,53.34
N$66
  Top 0.406: E10.11 64.77,45.72 63.5,44.45 60.96,44.45 59.69,45.72 E10.9
  Bottom 0.406: E7.8 26.67,34.29 41.91,34.29 45.72,36.83 48.26,39.37 55.88,41.91 | 55.88,41.91 58.42,44.45 E10.9 | 55.88,41.91 54.61,46.99 54.61,60.96 57.15,64.77 66.04,64.77 67.31,63.5 E16.12 E16.13
N$67
  Top 0.406: E16.2 67.31,72.39 E21.12
  Bottom 0.406: E16.2 E16.1 | E21.6 59.69,82.55 | 59.69,82.55 64.77,82.55 67.31,80.01 E21.12 | 59.69,82.55 57.15,82.55 52.07,87.63 48.26,88.9 41.91,91.44 39.37,91.44 34.29,90.17 26.67,90.17 E22.8
N$68  (via drill 0.81)
  Top 0.406: E21.9 E16.5 58.42,66.04 v52.07,66.04
  Bottom 0.406: E16.5 E16.4 | E18.8 26.67,67.31 36.83,67.31 41.91,68.58 45.72,68.58 50.8,66.04 v52.07,66.04 | E21.9 59.69,78.74 60.96,80.01 63.5,80.01 64.77,78.74 E21.11
N$69  (via drill 0.81)
  Top 0.406: E17.9 82.55,59.69 82.55,52.07 v81.28,49.53
  Bottom 0.406: E17.9 80.01,63.5 81.28,64.77 82.55,64.77 | 82.55,64.77 E17.10 | E17.13 90.17,63.5 88.9,64.77 87.63,64.77 | 87.63,64.77 E17.12 | 82.55,64.77 87.63,64.77 | U$3.AM2 10.16,35.56 19.05,35.56 34.29,26.67 50.8,16.51 74.93,16.51 77.47,19.05 77.47,25.4 81.28,30.48 86.36,43.18 86.36,44.45 v81.28,49.53
N$70
  Bottom 0.406: E16.8 55.88,58.42 55.88,49.53 | 55.88,49.53 E10.8 | E10.2 69.85,53.34 66.04,50.8 62.23,50.8 55.88,49.53
N$71
  Top 0.406: E10.5 63.5,57.15 | 63.5,57.15 E16.11 | E10.3 67.31,55.88 66.04,57.15 63.5,57.15
N$72
  Top 0.406: E21.2 66.04,81.28 60.96,81.28 E21.8
  Bottom 0.406: E16.3 63.5,66.04 58.42,66.04 55.88,68.58 55.88,73.66 E21.8
N$73  (via drill 0.81)
  Top 0.406: U$3.AA1 12.7,3.81 22.86,3.81 29.21,1.27 137.16,1.27 143.51,3.81 161.29,3.81 163.83,6.35 v163.83,10.16
  Bottom 0.406: E2.6 176.53,12.7 175.26,11.43 171.45,11.43 168.91,10.16 v163.83,10.16
N$74
  Top 0.406: E16.6 59.69,72.39 55.88,76.2 55.88,78.74 E21.5 64.77,82.55 66.04,82.55 67.31,83.82 E21.3
N$76  (via drill 0.81)
  Top 0.406: U$3.BL1 8.89,102.87 15.24,102.87 31.75,120.65 45.72,120.65 48.26,119.38 53.34,114.3 59.69,114.3 67.31,111.76 90.17,111.76 91.44,110.49 91.44,96.52 92.71,90.17 96.52,82.55 96.52,69.85 100.33,66.04 120.65,66.04 125.73,67.31 160.02,67.31 163.83,71.12 v163.83,73.66
  Bottom 0.406: v163.83,73.66 170.18,73.66 172.72,74.93 175.26,74.93 176.53,76.2 E20.6
N$77
  Bottom 0.406: E15.9 E9.4 E9.3
N$78
  Bottom 0.406: E15.13 E9.1
N$79  (via drill 0.81)
  Top 0.406: v168.91,43.18 182.88,43.18 E9.13
  Bottom 0.406: E14.13 v168.91,43.18
N$80
  Top 0.406: E9.10 176.53,41.91 167.64,41.91 165.1,44.45 162.56,44.45 161.29,43.18 154.94,43.18 149.86,48.26 149.86,54.61 151.13,55.88 152.4,55.88 153.67,54.61 E14.9
  Bottom 0.406: E9.11 E9.10
N$81  (via drill 0.81)
  Top 0.406: U$3.BP1 8.89,111.76 13.97,111.76 21.59,115.57 27.94,123.19 30.48,124.46 91.44,124.46 92.71,123.19 92.71,119.38 96.52,111.76 96.52,101.6 100.33,97.79 121.92,97.79 128.27,99.06 160.02,99.06 163.83,102.87 v163.83,105.41
  Bottom 0.406: v163.83,105.41 166.37,104.14 168.91,104.14 171.45,106.68 175.26,106.68 176.53,107.95 E28.6
N$82
  Bottom 0.406: E12.13 E8.1
N$83
  Top 0.406: E8.13 116.84,41.91 138.43,41.91 140.97,44.45 140.97,46.99 142.24,48.26 142.24,54.61 140.97,55.88 138.43,55.88 137.16,54.61 E13.13
N$84
  Bottom 0.406: E8.10 E8.11 109.22,40.64 111.76,43.18 124.46,43.18 127,45.72 E13.9
N$85
  Bottom 0.406: E2.9 176.53,6.35 172.72,3.81 165.1,2.54 38.1,2.54 34.29,3.81 24.13,13.97 10.16,13.97 U$3.AD2
N$86
  Bottom 0.406: U$3.BV2 11.43,128.27 13.97,128.27 20.32,127 31.75,127 44.45,130.81 63.5,130.81 67.31,128.27 76.2,121.92 80.01,121.92 87.63,118.11 93.98,118.11 102.87,111.76 E27.6
N$87
  Bottom 0.406: E12.9 E8.4 E8.3
N$88
  Bottom 0.406: E6.13 E2.1
N$89  (via drill 0.81)
  Top 0.406: v168.91,11.43 182.88,11.43 E2.13
  Bottom 0.406: E5.13 v168.91,11.43
N$90
  Top 0.406: E2.10 176.53,10.16 167.64,10.16 166.37,11.43 154.94,11.43 148.59,16.51 148.59,22.86 149.86,24.13 151.13,24.13 E5.9
  Bottom 0.406: E2.11 E2.10
N$91
  Bottom 0.406: U$3.AH2 10.16,22.86 20.32,22.86 39.37,15.24 53.34,10.16 68.58,10.16 72.39,8.89 81.28,8.89 85.09,11.43 92.71,19.05 93.98,21.59 93.98,41.91 95.25,43.18 96.52,43.18 97.79,41.91 100.33,36.83 102.87,34.29 135.89,34.29 139.7,35.56 149.86,35.56 153.67,34.29 167.64,34.29 172.72,35.56 175.26,36.83 E9.9
N$92
  Bottom 0.406: U$3.BS2 11.43,118.11 24.13,118.11 34.29,115.57 36.83,115.57 39.37,120.65 41.91,124.46 44.45,125.73 48.26,127 60.96,127 64.77,125.73 72.39,119.38 74.93,118.11 78.74,118.11 86.36,114.3 92.71,114.3 95.25,111.76 95.25,91.44 96.52,90.17 97.79,90.17 99.06,91.44 99.06,92.71 100.33,93.98 106.68,97.79 171.45,97.79 175.26,99.06 E28.9
N$93
  Bottom 0.406: E6.9 E2.4 E2.3
N$94
  Bottom 0.406: E32.13 E28.1
N$95  (via drill 0.81)
  Top 0.406: v168.91,106.68 181.61,106.68 E28.13
  Bottom 0.406: E31.13 v168.91,106.68
N$96
  Top 0.406: E28.10 175.26,105.41 167.64,105.41 165.1,107.95 163.83,107.95 161.29,105.41 157.48,105.41 149.86,111.76 149.86,116.84 151.13,118.11 152.4,118.11 153.67,116.84 E31.9
  Bottom 0.406: E28.10 E28.11
N$97
  Bottom 0.406: E32.9 E28.4 E28.3
N$98
  Bottom 0.406: U$3.BU2 10.16,124.46 13.97,124.46 20.32,125.73 31.75,125.73 44.45,129.54 62.23,129.54 67.31,127 76.2,120.65 80.01,120.65 87.63,116.84 93.98,116.84 96.52,114.3 E27.8
N$99
  Bottom 0.406: E23.13 E19.1
N$100
  Top 0.406: E24.13 140.97,87.63 142.24,87.63 143.51,86.36 143.51,82.55 138.43,74.93 120.65,74.93 E19.13
N$101
  Bottom 0.406: E23.9 E19.4 E19.3
N$102
  Bottom 0.406: E19.10 E19.11 109.22,71.12 113.03,74.93 125.73,74.93 128.27,77.47 E24.9
N$103
  Bottom 0.406: U$3.BN2 10.16,109.22 31.75,109.22 36.83,110.49 39.37,113.03 43.18,119.38 45.72,121.92 48.26,123.19 59.69,123.19 64.77,120.65 69.85,115.57 72.39,114.3 77.47,114.3 82.55,111.76 85.09,109.22 86.36,106.68 90.17,102.87 91.44,99.06 91.44,87.63 88.9,85.09 86.36,85.09 85.09,83.82 85.09,81.28 86.36,80.01 88.9,80.01 91.44,77.47 91.44,73.66 95.25,69.85 95.25,64.77 96.52,63.5 97.79,63.5 104.14,66.04 170.18,66.04 173.99,67.31 E20.9
N$104
  Bottom 0.406: E19.8 93.98,73.66 92.71,74.93 92.71,77.47 90.17,81.28 90.17,83.82 92.71,86.36 92.71,110.49 91.44,111.76 85.09,111.76 78.74,115.57 73.66,115.57 71.12,116.84 63.5,123.19 60.96,124.46 48.26,124.46 43.18,121.92 40.64,116.84 38.1,113.03 31.75,111.76 8.89,111.76 U$3.BP2
N$107
  Bottom 0.406: E26.13 E20.1
N$108  (via drill 0.81)
  Top 0.406: v168.91,74.93 181.61,74.93 E20.13
  Bottom 0.406: E25.13 166.37,78.74 v168.91,74.93
N$109
  Bottom 0.406: E29.13 E27.1
N$110
  Top 0.406: E30.13 138.43,116.84 139.7,118.11 140.97,118.11 143.51,115.57 143.51,111.76 137.16,105.41 118.11,105.41 E27.13
N$111
  Bottom 0.406: E27.10 E27.11 109.22,102.87 111.76,105.41 124.46,105.41 128.27,109.22 E30.9
N$113
  Bottom 0.406: E29.9 E27.4 E27.3
N$115
  Bottom 0.406: E26.9 E20.4 E20.3
N$116
  Top 0.406: E20.10 175.26,73.66 167.64,73.66 165.1,76.2 163.83,76.2 162.56,74.93 154.94,74.93 149.86,80.01 149.86,86.36 151.13,87.63 152.4,87.63 153.67,86.36 E25.9
  Bottom 0.406: E20.10 E20.11
Q1  (via drill 0.81)
  Top 0.406: v153.67,19.05 165.1,19.05 166.37,20.32 E5.14 166.37,22.86 167.64,24.13 173.99,24.13 | v137.16,19.05 125.73,19.05 124.46,20.32 E4.8 124.46,22.86 123.19,24.13 118.11,24.13 116.84,22.86 E3.14 | v137.16,50.8 125.73,50.8 124.46,52.07 E13.8 124.46,54.61 123.19,55.88 116.84,55.88 | v153.67,50.8 165.1,50.8 166.37,52.07 E14.14 166.37,54.61 167.64,55.88 173.99,55.88 | U$3.AP1 8.89,41.91 16.51,41.91 21.59,36.83 25.4,34.29 35.56,29.21 39.37,26.67 48.26,19.05 50.8,16.51 59.69,16.51 60.96,17.78 60.96,26.67 v62.23,34.29 | v153.67,113.03 163.83,113.03 E31.14 166.37,116.84 167.64,118.11 173.99,118.11 | v153.67,82.55 165.1,82.55 166.37,83.82 E25.14 166.37,86.36 167.64,87.63 173.99,87.63 | v138.43,82.55 127,82.55 125.73,83.82 E24.8 125.73,86.36 124.46,87.63 118.11,87.63 116.84,86.36 E23.14 | 173.99,24.13 E6.8 | v78.74,31.75 81.28,29.21 85.09,29.21 86.36,30.48 86.36,33.02 83.82,35.56 83.82,39.37 87.63,43.18 92.71,43.18 95.25,45.72 v95.25,50.8 96.52,52.07 96.52,54.61 95.25,55.88 R3.2 | 116.84,55.88 101.6,55.88 99.06,53.34 v99.06,50.8 | E12.14 116.84,55.88 | 173.99,87.63 E26.8 | E29.14 116.84,116.84 118.11,118.11 124.46,118.11 125.73,116.84 E30.8 128.27,113.03 v138.43,113.03 | 173.99,55.88 E15.8 | v203.2,120.65 204.47,120.65 205.74,119.38 205.74,115.57 204.47,114.3 201.93,114.3 198.12,118.11 173.99,118.11 | 173.99,118.11 E32.8 | v203.2,83.82 194.31,87.63 173.99,87.63 | v203.2,20.32 193.04,24.13 173.99,24.13 | v203.2,50.8 196.85,53.34 194.31,55.88 173.99,55.88
  Bottom 0.406: Q1.3 83.82,54.61 | 83.82,54.61 R2.1 | R3.2 83.82,54.61 | v137.16,19.05 v153.67,19.05 | v137.16,50.8 v153.67,50.8 | v62.23,34.29 64.77,30.48 68.58,27.94 69.85,27.94 73.66,31.75 v78.74,31.75 | v138.43,113.03 v153.67,113.03 | v138.43,82.55 v153.67,82.55 | v95.25,50.8 v99.06,50.8 | v203.2,120.65 208.28,111.76 208.28,86.36 205.74,83.82 | v203.2,20.32 205.74,22.86 205.74,41.91 v203.2,50.8 205.74,53.34 205.74,83.82 | v203.2,83.82 205.74,83.82
Q2  (via drill 0.81)
  Top 0.406: R5.1 Q2.3 | v80.01,13.97 v90.17,11.43 | E4.7 128.27,25.4 162.56,25.4 E5.1 | E25.1 166.37,90.17 | 166.37,90.17 173.99,90.17 | 173.99,90.17 E26.7 | E31.1 166.37,120.65 | 166.37,120.65 173.99,120.65 | 173.99,120.65 E32.7 | E30.7 129.54,119.38 165.1,119.38 166.37,120.65 | E24.7 129.54,88.9 165.1,88.9 166.37,90.17 | E13.7 128.27,57.15 162.56,57.15 E14.1 | 173.99,120.65 175.26,119.38 199.39,119.38 v203.2,115.57 | E6.7 177.8,25.4 193.04,25.4 v203.2,22.86 | v203.2,86.36 193.04,88.9 175.26,88.9 173.99,90.17 | v203.2,53.34 196.85,54.61 194.31,57.15 177.8,57.15 E15.7
  Bottom 0.406: R6.2 83.82,31.75 Q2.3 83.82,27.94 86.36,25.4 86.36,24.13 83.82,19.05 80.01,15.24 | E12.1 118.11,62.23 123.19,62.23 E13.7 | E14.1 167.64,62.23 172.72,62.23 E15.7 | U$3.AL2 10.16,33.02 17.78,33.02 21.59,31.75 29.21,27.94 49.53,15.24 80.01,15.24 | 80.01,15.24 v80.01,13.97 | E23.1 118.11,93.98 124.46,93.98 E24.7 | E4.7 123.19,30.48 118.11,30.48 E3.1 113.03,25.4 107.95,25.4 99.06,22.86 90.17,13.97 v90.17,11.43 | E5.1 167.64,30.48 172.72,30.48 E6.7 | E30.7 125.73,124.46 124.46,125.73 118.11,125.73 116.84,124.46 E29.1 | v203.2,115.57 205.74,109.22 205.74,91.44 204.47,90.17 201.93,90.17 200.66,88.9 200.66,86.36 | v203.2,86.36 200.66,86.36 | 200.66,86.36 200.66,83.82 201.93,78.74 204.47,72.39 204.47,62.23 200.66,54.61 200.66,53.34 | v203.2,22.86 204.47,24.13 204.47,41.91 201.93,48.26 200.66,52.07 200.66,53.34 | 200.66,53.34 v203.2,53.34
Q3  (via drill 0.81)
  Top 0.406: R9.2 Q3.3 | v193.04,100.33 194.31,101.6 v201.93,101.6 | v193.04,36.83 194.31,34.29 196.85,31.75 199.39,30.48 200.66,30.48 201.93,31.75 203.2,34.29 v203.2,38.1 | v203.2,69.85 199.39,71.12 196.85,71.12 v193.04,68.58
  Bottom 0.406: Q3.3 R8.1 44.45,33.02 26.67,33.02 24.13,34.29 20.32,36.83 15.24,39.37 11.43,39.37 U$3.AN2 | E15.5 179.07,64.77 | 179.07,64.77 182.88,64.77 v193.04,68.58 | E14.3 161.29,64.77 | 161.29,64.77 179.07,64.77 | E13.5 129.54,64.77 | 129.54,64.77 161.29,64.77 | 129.54,64.77 111.76,64.77 | 111.76,64.77 E12.3 | E23.3 111.76,95.25 113.03,96.52 130.81,96.52 | 130.81,96.52 E24.5 | 130.81,96.52 161.29,96.52 | 161.29,96.52 E25.3 | 161.29,96.52 179.07,96.52 | 179.07,96.52 E26.5 | 179.07,96.52 182.88,96.52 v193.04,100.33 | E3.3 115.57,33.02 129.54,33.02 | 129.54,33.02 E4.5 | 129.54,33.02 135.89,33.02 139.7,34.29 149.86,34.29 153.67,33.02 161.29,33.02 | 161.29,33.02 E5.3 | 161.29,33.02 179.07,33.02 | 179.07,33.02 E6.5 | 179.07,33.02 184.15,33.02 v193.04,36.83 | E29.3 111.76,125.73 114.3,128.27 130.81,128.27 | 130.81,128.27 E30.5 | 130.81,128.27 161.29,128.27 | 161.29,128.27 E31.3 | E32.5 179.07,128.27 | 179.07,128.27 161.29,128.27 | 179.07,128.27 200.66,128.27 201.93,127 201.93,124.46 200.66,120.65 200.66,115.57 201.93,105.41 v201.93,101.6 204.47,99.06 204.47,93.98 203.2,92.71 201.93,92.71 200.66,91.44 199.39,88.9 199.39,83.82 200.66,78.74 v203.2,69.85 203.2,63.5 201.93,60.96 199.39,53.34 199.39,50.8 201.93,44.45 v203.2,38.1 | R9.2 66.04,44.45 73.66,44.45 77.47,48.26 77.47,58.42 76.2,62.23 76.2,64.77 77.47,66.04 92.71,66.04 96.52,62.23 99.06,62.23 105.41,64.77 111.76,64.77
Q4  (via drill 0.81)
  Top 0.406: v95.25,36.83 91.44,31.75 88.9,25.4 83.82,20.32 82.55,17.78 77.47,17.78 72.39,13.97 63.5,13.97 | R11.1 63.5,29.21 63.5,13.97 | U$3.AN1 8.89,39.37 13.97,39.37 24.13,33.02 36.83,26.67 50.8,15.24 53.34,13.97 63.5,13.97 | E4.6 129.54,26.67 161.29,26.67 E5.2 | E30.6 130.81,120.65 161.29,120.65 E31.2 | E24.6 130.81,90.17 161.29,90.17 E25.2 | E13.6 129.54,58.42 161.29,58.42 E14.2 | E32.6 179.07,120.65 200.66,120.65 v203.2,118.11 | E6.6 179.07,26.67 199.39,26.67 203.2,29.21 204.47,33.02 204.47,40.64 203.2,41.91 198.12,41.91 196.85,43.18 196.85,44.45 198.12,45.72 201.93,45.72 205.74,49.53 205.74,53.34 v203.2,55.88 | v203.2,55.88 196.85,55.88 194.31,58.42 179.07,58.42 E15.6 | v203.2,55.88 205.74,60.96 205.74,71.12 203.2,73.66 198.12,73.66 196.85,74.93 196.85,76.2 198.12,77.47 203.2,77.47 205.74,80.01 205.74,86.36 v203.2,88.9 194.31,90.17 179.07,90.17 E26.6
  Bottom 0.406: Q4.3 69.85,35.56 | R11.1 69.85,35.56 | 69.85,35.56 R12.2 | E12.2 114.3,62.23 115.57,63.5 125.73,63.5 127,62.23 E13.6 | E14.2 163.83,62.23 165.1,63.5 175.26,63.5 176.53,62.23 E15.6 | E25.2 165.1,93.98 175.26,93.98 E26.6 | E23.2 114.3,93.98 115.57,95.25 125.73,95.25 E24.6 | E4.6 124.46,31.75 116.84,31.75 E3.2 111.76,26.67 106.68,26.67 102.87,25.4 100.33,25.4 97.79,27.94 v95.25,36.83 | E5.2 163.83,30.48 165.1,31.75 173.99,31.75 E6.6 | E29.2 114.3,124.46 116.84,127 125.73,127 128.27,124.46 E30.6 | E31.2 163.83,124.46 165.1,125.73 175.26,125.73 176.53,124.46 E32.6 | v203.2,118.11 207.01,110.49 207.01,91.44 204.47,88.9 v203.2,88.9
Q5  (via drill 0.81)
  Top 0.406: E3.8 101.6,20.32 102.87,19.05 118.11,19.05 127,16.51 138.43,16.51 139.7,17.78 E4.14 | E12.8 104.14,50.8 116.84,50.8 129.54,48.26 138.43,48.26 139.7,49.53 E13.14 | v48.26,115.57 52.07,113.03 59.69,113.03 62.23,110.49 62.23,109.22 R14.1 | v60.96,118.11 66.04,120.65 81.28,120.65 83.82,119.38 v90.17,119.38 | E5.8 151.13,17.78 152.4,16.51 165.1,16.51 172.72,19.05 187.96,19.05 189.23,20.32 E6.14 | v195.58,27.94 191.77,34.29 191.77,49.53 190.5,52.07 | 190.5,52.07 E15.14 | 190.5,52.07 189.23,50.8 172.72,50.8 163.83,48.26 152.4,48.26 151.13,49.53 E14.8 | v194.31,93.98 191.77,99.06 191.77,113.03 E32.14 187.96,114.3 170.18,114.3 163.83,111.76 152.4,111.76 151.13,113.03 E31.8 | v195.58,60.96 191.77,67.31 191.77,82.55 190.5,83.82 | 190.5,83.82 E26.14 | 190.5,83.82 189.23,82.55 170.18,82.55 163.83,80.01 152.4,80.01 151.13,81.28 E25.8 | E23.8 101.6,83.82 102.87,82.55 121.92,82.55 129.54,80.01 139.7,80.01 140.97,81.28 E24.14 | E29.8 102.87,114.3 121.92,114.3 128.27,111.76 139.7,111.76 140.97,113.03 E30.14
  Bottom 0.406: Q5.3 69.85,107.95 | 69.85,107.95 R15.2 | 69.85,107.95 R14.1 62.23,109.22 62.23,110.49 60.96,111.76 48.26,111.76 46.99,110.49 45.72,106.68 44.45,104.14 41.91,102.87 35.56,100.33 24.13,100.33 20.32,99.06 15.24,96.52 8.89,96.52 U$3.BJ2 | E6.14 190.5,20.32 193.04,19.05 194.31,19.05 195.58,20.32 v195.58,27.94 | E13.14 140.97,52.07 149.86,52.07 E14.8 | E15.14 191.77,50.8 194.31,50.8 195.58,52.07 v195.58,60.96 | E4.14 142.24,20.32 148.59,20.32 E5.8 | E24.14 142.24,83.82 149.86,83.82 E25.8 | E30.14 142.24,114.3 149.86,114.3 E31.8 | E29.8 95.25,119.38 v90.17,119.38 | E26.14 193.04,82.55 194.31,82.55 195.58,83.82 195.58,92.71 v194.31,93.98 | v60.96,118.11 57.15,115.57 v48.26,115.57
Q6  (via drill 0.81)
  Top 0.406: v40.64,109.22 45.72,111.76 53.34,111.76 R18.2 | v54.61,119.38 60.96,123.19 83.82,123.19 v85.09,121.92 | E3.7 105.41,33.02 138.43,33.02 139.7,31.75 E4.1 | E5.7 154.94,33.02 186.69,33.02 189.23,30.48 E6.1 | v199.39,44.45 203.2,44.45 207.01,49.53 207.01,53.34 205.74,57.15 207.01,60.96 207.01,72.39 205.74,73.66 205.74,76.2 | v199.39,76.2 205.74,76.2 | 205.74,76.2 205.74,77.47 207.01,78.74 207.01,90.17 v203.2,96.52 | E32.1 189.23,128.27 | 189.23,128.27 195.58,128.27 v199.39,125.73 | E31.7 151.13,128.27 | 151.13,128.27 189.23,128.27 | E15.1 189.23,62.23 186.69,64.77 151.13,64.77 | E14.7 151.13,64.77 | E13.1 139.7,64.77 | 139.7,64.77 151.13,64.77 | E12.7 105.41,64.77 139.7,64.77 | E23.7 105.41,96.52 140.97,96.52 | 140.97,96.52 E24.1 | 140.97,96.52 151.13,96.52 | 151.13,96.52 E25.7 | E26.1 189.23,93.98 186.69,96.52 151.13,96.52 | E29.7 101.6,127 102.87,128.27 140.97,128.27 | 140.97,128.27 E30.1 | 140.97,128.27 151.13,128.27
  Bottom 0.406: R17.1 54.61,107.95 | 54.61,107.95 Q6.3 52.07,104.14 40.64,100.33 35.56,99.06 24.13,99.06 19.05,96.52 15.24,92.71 8.89,92.71 U$3.BH2 | 54.61,107.95 R18.2 | E15.1 190.5,62.23 193.04,63.5 200.66,63.5 201.93,64.77 201.93,67.31 199.39,73.66 v199.39,76.2 | E4.1 142.24,30.48 148.59,30.48 E5.7 | E6.1 193.04,31.75 195.58,33.02 198.12,35.56 199.39,38.1 v199.39,44.45 | E29.7 99.06,124.46 86.36,124.46 85.09,123.19 v85.09,121.92 | E26.1 191.77,95.25 196.85,96.52 v203.2,96.52 200.66,100.33 199.39,111.76 v199.39,125.73 | v40.64,109.22 43.18,113.03 45.72,118.11 46.99,119.38 v54.61,119.38
Q7  (via drill 0.81)
  Top 0.406: E3.6 106.68,31.75 135.89,31.75 137.16,30.48 E4.2 | E5.6 156.21,31.75 185.42,31.75 186.69,30.48 E6.2 | v199.39,92.71 v199.39,97.79 | E31.6 153.67,125.73 154.94,127 185.42,127 186.69,125.73 E32.2 | v199.39,60.96 v199.39,66.04 | E14.6 153.67,62.23 154.94,63.5 185.42,63.5 186.69,62.23 E15.2 | E12.6 106.68,63.5 135.89,63.5 137.16,62.23 E13.2 | R21.2 90.17,91.44 91.44,90.17 91.44,87.63 v93.98,82.55 | E23.6 106.68,95.25 135.89,95.25 E24.2 | E25.6 156.21,95.25 185.42,95.25 186.69,93.98 E26.2 | E29.6 104.14,125.73 105.41,127 137.16,127 138.43,125.73 E30.2
  Bottom 0.406: R20.1 83.82,90.17 | 83.82,90.17 Q7.3 | R21.2 83.82,90.17 | E15.2 189.23,63.5 191.77,64.77 v199.39,66.04 199.39,68.58 196.85,74.93 196.85,77.47 198.12,81.28 198.12,88.9 v199.39,92.71 | E13.2 138.43,62.23 152.4,62.23 E14.6 | E4.2 140.97,31.75 149.86,31.75 E5.6 | U$3.BK2 11.43,99.06 13.97,99.06 20.32,101.6 24.13,102.87 36.83,102.87 43.18,105.41 45.72,110.49 48.26,113.03 60.96,113.03 66.04,111.76 76.2,111.76 77.47,110.49 77.47,105.41 85.09,100.33 86.36,99.06 83.82,91.44 83.82,90.17 | E24.2 139.7,93.98 152.4,93.98 E25.6 | E23.6 102.87,90.17 96.52,86.36 v93.98,82.55 | E6.2 189.23,31.75 195.58,34.29 196.85,36.83 196.85,46.99 198.12,50.8 v199.39,60.96 | E31.6 153.67,124.46 152.4,125.73 139.7,125.73 138.43,124.46 E30.2 | E32.2 189.23,125.73 194.31,125.73 195.58,124.46 195.58,113.03 198.12,110.49 198.12,102.87 v199.39,97.79 190.5,96.52 E26.2
Q8  (via drill 0.81)
  Top 0.406: R24.2 Q8.3 | v58.42,119.38 64.77,121.92 81.28,121.92 83.82,120.65 86.36,120.65 v87.63,121.92 | E4.3 133.35,30.48 120.65,30.48 116.84,26.67 109.22,26.67 E3.5 | E5.5 157.48,30.48 182.88,30.48 E6.3 | v196.85,93.98 v196.85,100.33 | v195.58,110.49 v196.85,114.3 | E32.3 184.15,124.46 182.88,125.73 157.48,125.73 156.21,124.46 E31.5 | v196.85,58.42 v196.85,68.58 | E14.5 157.48,62.23 182.88,62.23 E15.3 | E13.3 133.35,62.23 120.65,62.23 116.84,58.42 109.22,58.42 E12.5 | E24.3 134.62,93.98 107.95,93.98 E23.5 | E25.5 157.48,93.98 182.88,93.98 E26.3 | E29.5 106.68,124.46 107.95,125.73 134.62,125.73 135.89,124.46 E30.3
  Bottom 0.406: Q8.3 83.82,106.68 | 83.82,106.68 R23.1 | 83.82,106.68 82.55,110.49 77.47,113.03 66.04,113.03 60.96,114.3 45.72,114.3 | 45.72,114.3 45.72,115.57 46.99,118.11 50.8,118.11 54.61,116.84 58.42,118.11 v58.42,119.38 | 45.72,114.3 41.91,106.68 38.1,105.41 29.21,104.14 24.13,104.14 17.78,102.87 8.89,102.87 U$3.BL2 | E15.3 187.96,64.77 190.5,66.04 195.58,67.31 v196.85,68.58 195.58,72.39 195.58,78.74 196.85,83.82 v196.85,93.98 | E14.5 153.67,63.5 137.16,63.5 E13.3 | E4.3 139.7,33.02 149.86,33.02 E5.5 | E24.3 135.89,93.98 137.16,95.25 154.94,95.25 156.21,93.98 E25.5 | E6.3 186.69,31.75 190.5,34.29 193.04,34.29 195.58,36.83 195.58,48.26 196.85,52.07 v196.85,58.42 | E30.3 135.89,124.46 138.43,127 153.67,127 156.21,124.46 E31.5 | E26.3 187.96,96.52 195.58,99.06 v196.85,100.33 v195.58,110.49 | E32.3 187.96,127 195.58,127 196.85,125.73 v196.85,114.3 | E29.5 104.14,120.65 99.06,120.65 93.98,121.92 v87.63,121.92
VCC  (via drill 0.81)
  Top 0.813: R8.2 R7.2 C35.1 | v96.52,40.64 R1.2 C33.1 86.36,36.83 R5.2 | C36.1 69.85,22.86 R10.2 R11.2 72.39,36.83 C10.1 E10.14 | E7.14 C7.1 45.72,40.64 45.72,46.99 43.18,49.53 C11.1 | C22.1 E22.14 39.37,83.82 45.72,78.74 45.72,74.93 C18.1 | C18.1 E18.14 C42.+ | C18.1 C42.+ | v19.05,68.58 24.13,66.04 C42.+ | R26.2 171.45,5.08 172.72,3.81 187.96,3.81 189.23,5.08 E2.14 | E9.14 189.23,35.56 | 189.23,35.56 172.72,35.56 171.45,36.83 R28.2 | 189.23,35.56 189.23,34.29 193.04,29.21 C6.1 | v147.32,48.26 v147.32,53.34 | C15.1 189.23,67.31 | 189.23,67.31 E20.14 | 189.23,67.31 172.72,67.31 171.45,68.58 R34.2 | R23.2 R22.2 | 88.9,80.01 R20.2 85.09,92.71 | 88.9,80.01 R19.2 C39.1 | v95.25,80.01 88.9,80.01 | C37.1 76.2,88.9 78.74,86.36 80.01,86.36 82.55,88.9 82.55,90.17 85.09,92.71 | 85.09,92.71 C40.1 | v50.8,58.42 55.88,64.77 72.39,64.77 | R2.2 86.36,55.88 C17.1 88.9,58.42 91.44,59.69 92.71,60.96 E17.14 90.17,64.77 72.39,64.77 | C32.1 194.31,123.19 205.74,123.19 207.01,121.92 207.01,113.03 199.39,107.95 196.85,106.68 C28.1 | C26.1 189.23,96.52 189.23,97.79 | 189.23,97.79 173.99,97.79 171.45,100.33 R36.2 | E28.14 189.23,97.79 | E16.14 72.39,64.77 | C41.+ v26.67,7.62
  Bottom 0.813: C36.1 60.96,20.32 | 60.96,20.32 C35.1 R7.2 60.96,20.32 | R2.2 R1.2 | C34.1 R4.2 R5.2 | E1.14 C1.1 R25.2 127,6.35 140.97,6.35 R29.2 R30.2 153.67,6.35 165.1,6.35 R26.2 | R14.2 R13.2 C37.1 69.85,91.44 62.23,91.44 59.69,92.71 | E21.14 72.77,76.33 | 72.77,76.33 C21.1 74.93,72.39 74.93,66.04 E16.14 C16.1 74.93,57.15 74.93,49.53 E10.14 | C40.1 R22.2 | R16.2 C38.1 59.69,92.71 | R16.2 R17.2 | 59.69,92.71 R16.2 | R19.2 C39.1 82.55,77.47 80.01,80.01 78.74,80.01 72.77,76.33 | 140.97,38.1 124.46,38.1 123.19,39.37 R27.2 C8.1 E8.14 | 140.97,38.1 143.51,38.1 R31.2 R32.2 153.67,38.1 168.91,38.1 R28.2 | E19.14 C19.1 R33.2 128.27,69.85 140.97,69.85 R37.2 R38.2 154.94,69.85 166.37,69.85 R34.2 | E27.14 C27.1 R35.2 128.27,101.6 142.24,101.6 R39.2 R40.2 152.4,101.6 166.37,101.6 R36.2 | U$3.AA2 10.16,3.81 26.67,3.81 | 26.67,3.81 34.29,1.27 171.45,1.27 181.61,3.81 187.96,3.81 189.23,5.08 E2.14 C2.1 196.85,13.97 198.12,22.86 198.12,29.21 196.85,30.48 194.31,30.48 193.04,29.21 C6.1 190.5,26.67 181.61,26.67 | 26.67,3.81 v26.67,7.62 | E17.14 99.06,57.15 109.22,57.15 | 109.22,57.15 E12.4 | C12.1 120.65,58.42 | 120.65,58.42 113.03,58.42 109.22,57.15 | E13.4 132.08,57.15 | 132.08,57.15 123.19,57.15 120.65,58.42 | C13.1 143.51,57.15 | 143.51,57.15 132.08,57.15 | 143.51,57.15 147.32,55.88 | 147.32,55.88 v147.32,53.34 | E14.4 158.75,58.42 | 158.75,58.42 156.21,57.15 151.13,55.88 147.32,55.88 | C14.1 170.18,58.42 | 170.18,58.42 158.75,58.42 | E15.4 181.61,58.42 | 181.61,58.42 170.18,58.42 | C15.1 191.77,58.42 181.61,58.42 | E28.14 C28.1 | E23.4 109.22,90.17 | 109.22,90.17 102.87,87.63 97.79,85.09 v95.25,80.01 | C23.1 120.65,90.17
  Bottom 0.813: 120.65,90.17 109.22,90.17 | E24.4 133.35,90.17 | 133.35,90.17 120.65,90.17 | C24.1 144.78,90.17 | 144.78,90.17 133.35,90.17 | E25.4 158.75,90.17 | 158.75,90.17 144.78,90.17 | C25.1 170.18,90.17 | 170.18,90.17 158.75,90.17 | E26.4 181.61,90.17 | 181.61,90.17 170.18,90.17 | C26.1 190.5,90.17 181.61,90.17 | 140.97,38.1 140.97,46.99 142.24,48.26 v147.32,48.26 | U$3.BA2 10.16,73.66 17.78,73.66 19.05,72.39 v19.05,68.58 | C42.+ 40.64,66.04 45.72,62.23 | 45.72,62.23 45.72,59.69 C11.1 | C11.1 48.26,58.42 | v50.8,58.42 48.26,58.42 | 48.26,58.42 45.72,62.23 | E11.14 C11.1 | E20.14 C20.1 | E6.4 181.61,26.67 | 181.61,26.67 170.18,26.67 | 170.18,26.67 C5.1 | C3.1 123.19,25.4 127,25.4 132.08,26.67 | 132.08,26.67 E4.4 | C4.1 144.78,26.67 | 144.78,26.67 132.08,26.67 | E5.4 158.75,26.67 | 158.75,26.67 144.78,26.67 | 158.75,26.67 170.18,26.67 | E29.4 111.76,120.65 120.65,120.65 | 120.65,120.65 C29.1 | E30.4 133.35,120.65 | 133.35,120.65 120.65,120.65 | C30.1 144.78,120.65 | 144.78,120.65 133.35,120.65 | E31.4 158.75,120.65 | 158.75,120.65 144.78,120.65 | C31.1 170.18,120.65 | 170.18,120.65 158.75,120.65 | E32.4 181.61,120.65 | 181.61,120.65 170.18,120.65 | C32.1 189.23,120.65 181.61,120.65 | E3.4 106.68,31.75 101.6,31.75 v96.52,40.64 | E9.14 C9.1

## Text on the board
Top: FLIP CHIP
Bottom: MEMORY | M225A